# EAGLE design EventCounter_I2C (EAGLE 9.2.1)

## Sheet 1 of 2
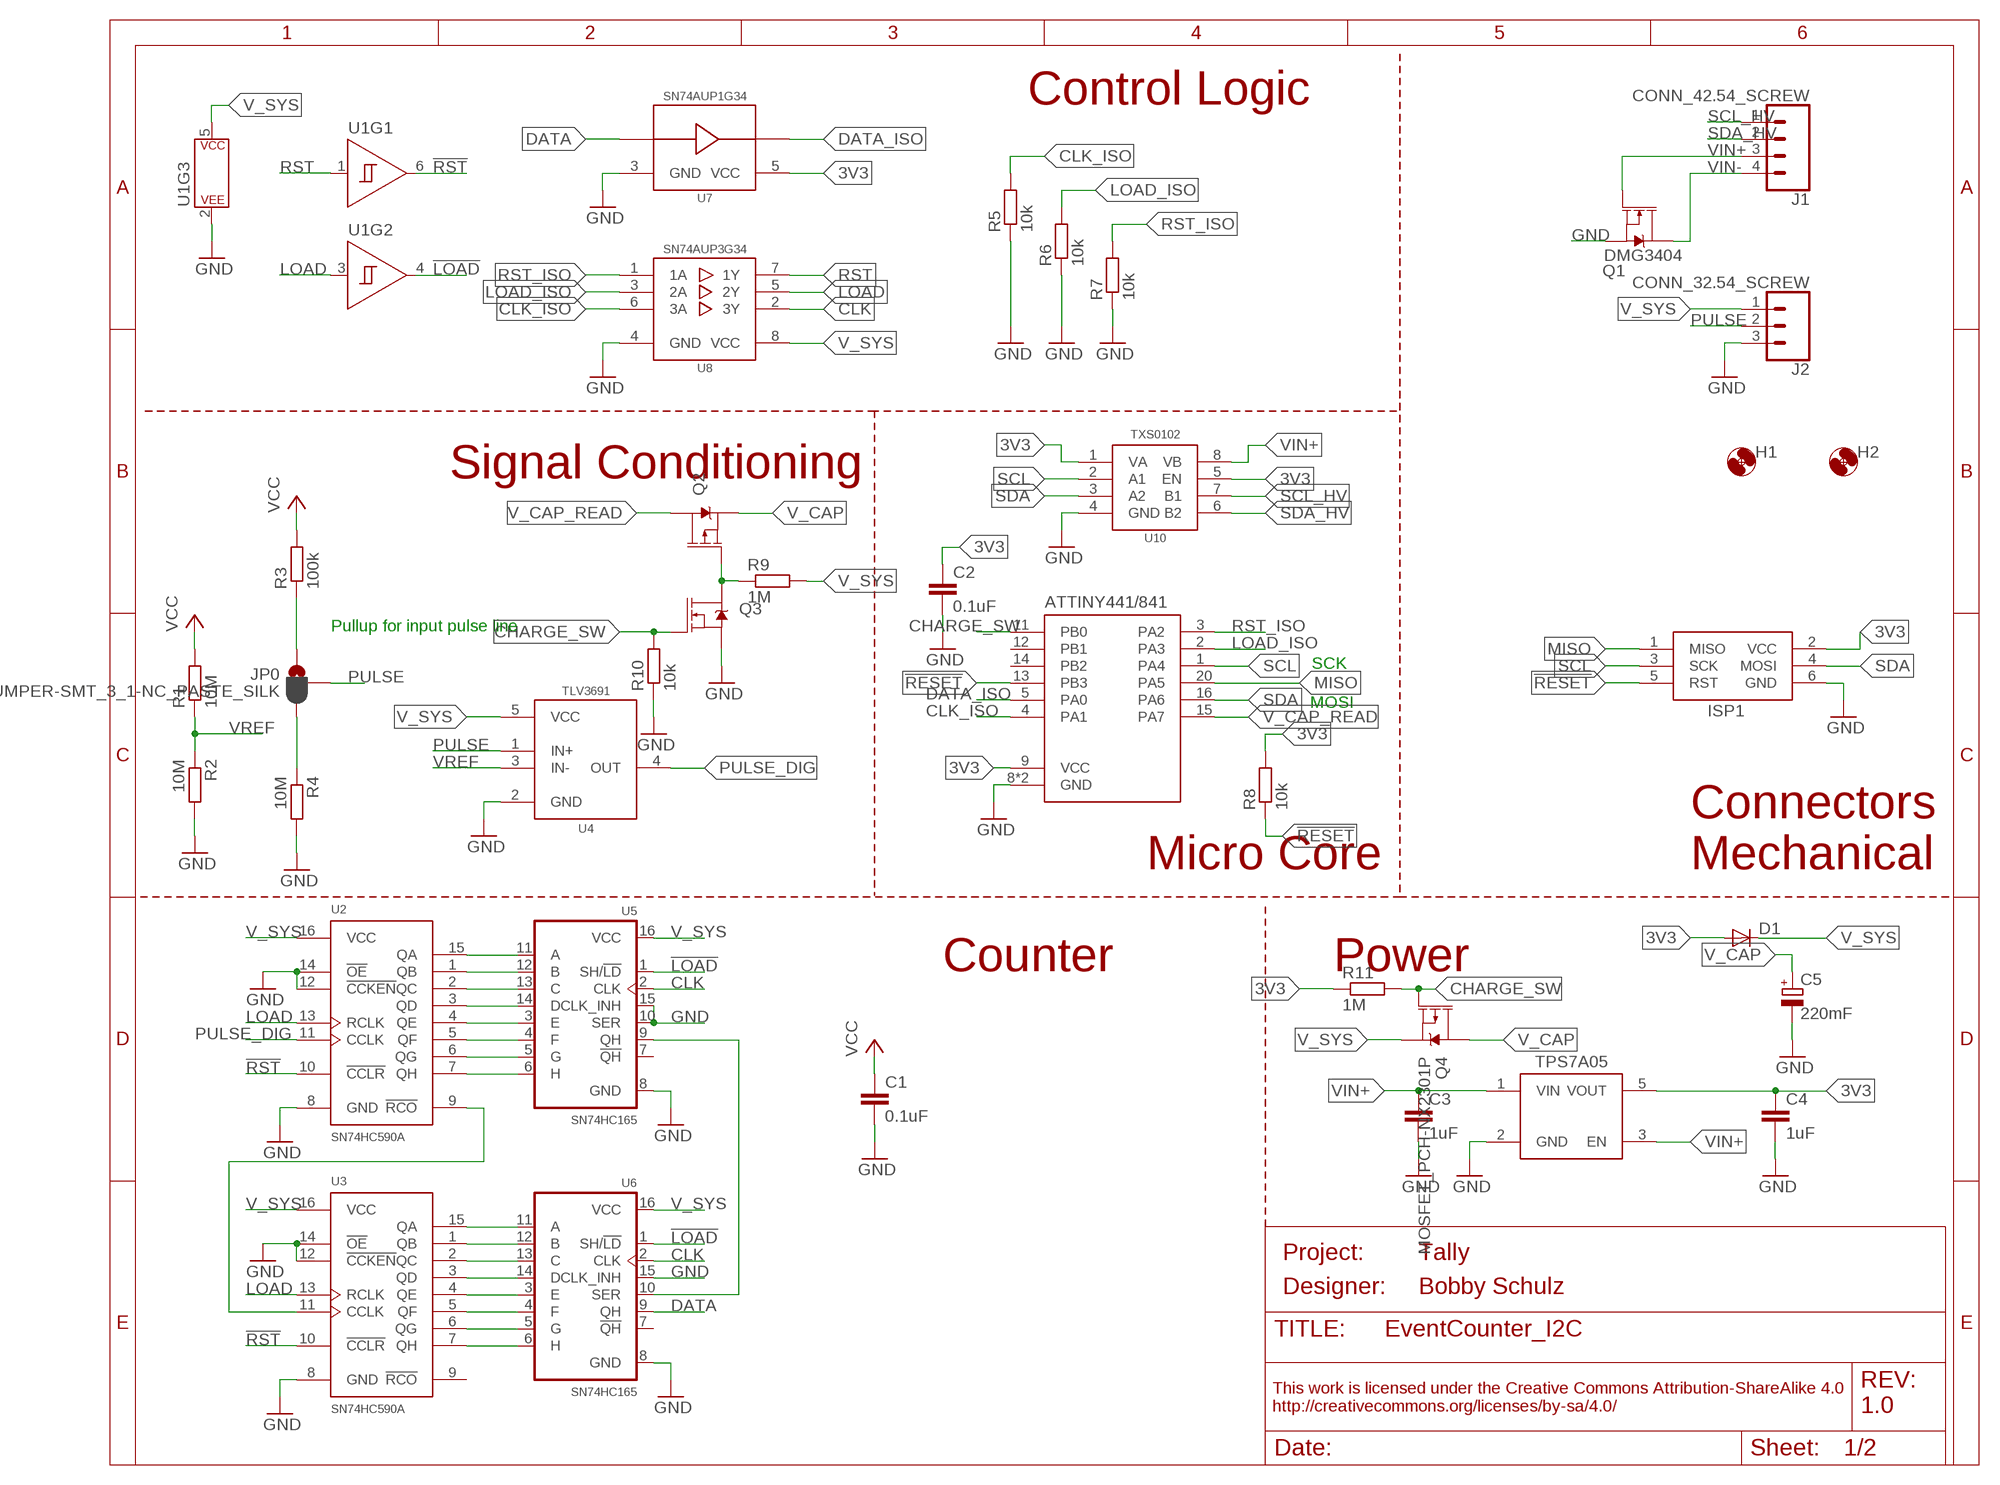
[diagram p0: schematic, sheet 1]
FRAME1 (FRAME_A_L): DESIGNER: Bobby Schulz; PROJECT: Tally; REV: 1.0

### Parts
C1  0.1uF  C-EU0.1UFC0402  [C0402]
C2  0.1uF  C-EU0.1UFC0402  [C0402]
C3  1uF  C-EU1UFC0603  [C0603]
C4  1uF  C-EU1UFC0603  [C0603]
C5  220mF  CPOL-EUHL  [HL]
D1  DIODESOD-123  [SOD-123]
H1  MOUNTING_HOLE2_NP  [2_56]
H2  MOUNTING_HOLE2_NP  [2_56]
ISP1  AVRISP1.27MM  [2X3_1.27]
J1  CONN_42.54_SCREW  [1X04_SCREW]
J2  CONN_32.54_SCREW  [1X03_SCREW]
JP0  JUMPER-SMT_3_1-NC_PASTE_SILK  [SMT-JUMPER_3_1-NC_PASTE_SILK]
Q1  DMG3404  MOSFET-NCH-DMG3404L  [SOT23-3]
Q2  MOSFET_PCH-RZM001P02  [SOT723]
Q3  MOSFET-NCH-RE1C002UN  [SC-89]
Q4  MOSFET_PCH-NX2301P  [SOT23-3]
R1  10M  R-EU_10MR0603  [R0603]
R2  10M  R-EU_10MR0603  [R0603]
R3  100k  R-EU_100KR0603  [R0603]
R4  10M  R-EU_10MR0603  [R0603]
R5  10k  R-EU_10KR0402  [R0402]
R6  10k  R-EU_10KR0402  [R0402]
R7  10k  R-EU_10KR0402  [R0402]
R8  10k  R-EU_10KR0402  [R0402]
R9  1M  R-EU_1MR0402  [R0402]
R10  10k  R-EU_10KR0402  [R0402]
R11  1M  R-EU_1MR0402  [R0402]
U1  SN74AUP2G14SC70  [DCK_R-PDSO-G6]
U2  SN74HC590AD  [SO16]
U3  SN74HC590AD  [SO16]
U4  TLV3691DCK  [DCK_R-PDSO-G5]
U5  SN74HC165PW  [TSSOP16]
U6  SN74HC165PW  [TSSOP16]
U7  SN74AUP1G34SC70  [DCK_R-PDSO-G5]
U8  SN74AUP3G34DCU  [DCU_(R-PDSO-G8)]
U9  ATTINY441/841VQFN  [VQFN-20]
U10  TXS0102DQM  [DQM_R-PX2SON-N8]
U11  TPS7A0533DBV  [SOT23-5]

### Nets
3V3: C2.1 C4.1 D1.ANODE(A) ISP1.2(VCC) R8.2 R11.1 U7.5(VCC) U9.9(VCC) U10.1(VA) U10.5(EN) U11.5(VOUT)
!LOAD: U1.4(Y) U5.1(SH/!LD) U6.1(SH/!LD)
!RESET: ISP1.5(RST) R8.1 U9.13(PB3)
!RST: U1.6(Y) U2.10(!CCLR) U3.10(!CCLR)
CHARGE_SW: Q3.1(G) Q4.1(G) R10.2 R11.2 U9.11(PB0)
CLK: U5.2(CLK) U6.2(CLK) U8.2(3Y)
CLK_ISO: R5.2 U8.6(3A) U9.4(PA1)
DATA: U6.9(QH) U7.2(A)
DATA_ISO: U7.4(Y) U9.5(PA0)
GND: C1.2 C2.2 C3.2 C4.2 C5.- ISP1.6(GND) J2.3 Q1.2(S) Q3.2(S) R2.2 R4.2 R5.1 R6.1 R7.1 R10.1 U1.2(P$V-) U2.8(GND) U2.12(!CCKEN) U2.14(!OE) U3.8(GND) U3.12(!CCKEN) U3.14(!OE) U4.2(GND) U5.8(GND) U5.10(SER) U5.15(CLK_INH) U6.8(GND) U6.15(CLK_INH) U7.3(GND) U8.4(GND) U9.8(GND) U9.EP(GND) U10.4(GND) U11.2(GND)
LOAD: U1.3(A) U2.13(RCLK) U3.13(RCLK) U8.5(2Y)
LOAD_ISO: R6.2 U8.3(2A) U9.2(PA3)
MISO: ISP1.1(MISO) U9.20(PA5)
N$1: U3.15(QA) U6.11(A)
N$2: U3.1(QB) U6.12(B)
N$3: U3.2(QC) U6.13(C)
N$4: U3.3(QD) U6.14(D)
N$5: U3.4(QE) U6.3(E)
N$6: U3.5(QF) U6.4(F)
N$7: U3.6(QG) U6.5(G)
N$8: U3.7(QH) U6.6(H)
N$9: U2.7(QH) U5.6(H)
N$10: U2.6(QG) U5.5(G)
N$11: U2.5(QF) U5.4(F)
N$12: U2.4(QE) U5.3(E)
N$13: U2.3(QD) U5.14(D)
N$14: U2.2(QC) U5.13(C)
N$15: U2.1(QB) U5.12(B)
N$16: U2.15(QA) U5.11(A)
N$17: U5.9(QH) U6.10(SER)
N$18: U2.9(!RCO) U3.11(CCLK)
N$19: JP0.3 R4.1
N$20: JP0.1 R3.1
N$21: Q2.1(G) Q3.3(D) R9.1
PULSE: J2.2 JP0.2 U4.1(IN+)
PULSE_DIG: U2.11(CCLK) U4.4(OUT)
RST: U1.1(A) U8.7(1Y)
RST_ISO: R7.2 U8.1(1A) U9.3(PA2)
SCL: ISP1.3(SCK) U9.1(PA4) U10.2(A1)
SCL_HV: J1.1 U10.7(B1)
SDA: ISP1.4(MOSI) U9.16(PA6) U10.3(A2)
SDA_HV: J1.2 U10.6(B2)
V_CAP: C5.+ Q2.2(S) Q4.3(D)
V_CAP_READ: Q2.3(D) U9.15(PA7)
V_SYS: C1.1 D1.CAT(C) J2.1 Q4.2(S) R1.2 R3.2 R9.2 U1.5(P$V+) U2.16(VCC) U3.16(VCC) U4.5(VCC) U5.16(VCC) U6.16(VCC) U8.8(VCC) ; supply symbol labelled VCC
VIN+: C3.1 J1.3 Q1.1(G) U10.8(VB) U11.1(VIN) U11.3(EN)
VIN-: J1.4 Q1.3(D)
VREF: R1.1 R2.1 U4.3(IN-)
Unconnected: U3.9(!RCO) U5.7(!QH) U6.7(!QH) U9.12(PB1) U9.14(PB2)

### Notes on the sheet
- Control Logic
- Signal Conditioning
- Pullup for input pulse line
- SCK
- MOSI
- Micro Core
- Connectors
  Mechanical
- Counter | Power

## Sheet 2 of 2

## Library data of the parts
C1 C2 = bschulz_passives:C-EU: CAPACITOR, European symbol; DIGIKEY: 490-4759-1-ND; MF: Murata; MPN: GCM155R71C104KA55D
C3 C4 = bschulz_passives:C-EU: CAPACITOR, European symbol; DIGIKEY: 490-10479-1-ND; MF: Murata; MPN: GRM188R61C105KA12D
C5 = bschulz_passives:CPOL-EU: POLARIZED CAPACITOR, European symbol; DIGIKEY: 604-1020-1-ND; MF: Elna; MPN: DSK-3R3H224U-HL
D1 = bschulz:DIODE: Genaric Diode; DIGIKEY: BAT43W-FDICT-ND; MF: Diodes Incorporated; MPN: BAT43W-7-F
H1 H2 = bschulz:MOUNTING_HOLE: Genaric Mechanical Mounting Hole Hole diameter based on max body diameter + 15% Keepout ring is for diameter of socket cap screw (minimum required clearance) TPlace ring is for diameter of pan head screw (recomended clearance) Specifications: Socket Cap <http://fastener-express.com/fastener-technical/SocketscapSS-Alloy.pdf> Button Head Socket Cap <http://fastener-express.com/fastener-technical/Button-Socket-alloy.pdf> Pan Head <http://fastener-express.com/fastener-technical/pan-machine-Screws.pdf>
ISP1 = bschulz:AVRISP: AVR ISP HEADER Standard 6 pin header for AVR programming
J1 = bschulz:CONN_4: Genaric 4 terminal header Digikey 2.54_SCREW <https://www.digikey.com/product-detail/en/on-shore-technology-inc/OSTVN04A150/ED10563-ND/1588864>; DIGIKEY: ED10563-ND; MF: On Shore; MPN: OSTVN04A150
J2 = bschulz:CONN_3: Genaric 3 terminal header Digikey 2.54_SCREW <https://www.digikey.com/product-detail/en/on-shore-technology-inc/OSTVN03A150/ED10562-ND/1588863> 3.5_SCREW <https://www.digikey.com/product-detail/en/on-shore-technology-inc/OSTTE030161/ED2636-ND/614585>; DIGIKEY: ED10562-ND; MF: On Shore; MPN: OSTVN03A150
JP0 = SparkFun-Jumpers:JUMPER-SMT_3_1-NC_PASTE: Normally closed solder jumper (1 of 2 connections) This jumper has an aperture in the stencil to allow solder paste to bridge one of the two connections. One connection is normally closed (NC), while the other is normally open (NO). Wick off the solder to open the connection. Reapply solder to reclose the connection. Apply solder to the other side instead to change the current path.
Q1 = bschulz:MOSFET-NCH: N-channel MOSFETs Voltage controlled devices that allow control of high current outputs. SparkFun Products: SparkFun OpenScale <https://www.sparkfun.com/products/13261> SparkFun Digital Sandbox <https://www.sparkfun.com/products/12651> SparkFun Monster Moto Shield <https://www.sparkfun.com/products/10182> SparkFun MOSFET Power Controller <https://www.sparkfun.com/products/11214>; DIGIKEY: DMG3404L-7DICT-ND; MF: Diodes Incorporated; MPN: DMG3404L-7
Q2 = bschulz:MOSFET_PCH: P-channel MOSFETs Voltage controlled devices that allow control of high current outputs. SparkFun Products: SparkFun ESP32 Thing <https://www.sparkfun.com/products/13907> SparkFun ESP8266 Thing <https://www.sparkfun.com/products/13231>; DIGIKEY: RZM001P02T2LCT-ND; MF: Rohm; MPN: RZM001P02T2L
Q3 = bschulz:MOSFET-NCH: N-channel MOSFETs Voltage controlled devices that allow control of high current outputs. SparkFun Products: SparkFun OpenScale <https://www.sparkfun.com/products/13261> SparkFun Digital Sandbox <https://www.sparkfun.com/products/12651> SparkFun Monster Moto Shield <https://www.sparkfun.com/products/10182> SparkFun MOSFET Power Controller <https://www.sparkfun.com/products/11214>; DIGIKEY: RE1C002UNTCLCT-ND; MF: Rohm; MPN: RE1C002UNTCL
Q4 = bschulz:MOSFET_PCH: P-channel MOSFETs Voltage controlled devices that allow control of high current outputs. SparkFun Products: SparkFun ESP32 Thing <https://www.sparkfun.com/products/13907> SparkFun ESP8266 Thing <https://www.sparkfun.com/products/13231>; DIGIKEY: 1727-1148-1-ND; MF: Nexperia; MPN: NX2301P,215
R1 R2 R4 = bschulz_passives:R-EU_: RESISTOR, European symbol Digikey Parts: Yageo, 0402 <https://www.digikey.com/products/en/resistors/chip-resistor-surface-mount/52?k=&pkeyword=&sf=0&FV=ffec1104%2Cfffc000d%2C1c0002%2C440067%2C1f140000%2Cffe00034%2C400004&quantity=&ColumnSort=0&page=1&stock=1&pageSize=25> Yageo, 0603 <https://www.digikey.com/products/en/resistors/chip-resistor-surface-mount/52?k=&pkeyword=&s=4356&s=47360&sf=0&FV=fffc000d%2C1c0002%2C142c040c%2C1f140000%2Cffe00034&quantity=10&ColumnSort=1000011&page=1&stock=1&pageSize=25> Panasonic, 0603 <https://www.digikey.com/products/en/resistors/chip-resistor-surface-mount/52?k=&pkeyword=&pv252=68&sf=0&FV=ffec373d%2C1c0002%2C142c040c%2C1f140000%2Cffe00034%2C80002%2Cc0001&quantity=&ColumnSort=0&page=1&stock=1&pageSize=25> Panasonic, precision, 0603 <https://www.digikey.com/products/en/resistors/chip-resistor-surface-mount/52?FV=ffec4907%2Cfffc000a%2Cc0172%2C142c040c%2C1f140000%2Cffe00034%2C1c0002&quantity=100&ColumnSort=2085&page=1&stock=1&pageSize=25> Panasonic, 0805 <https://www.digikey.com/products/en/resistors/chip-resistor-surface-mount/52?k=&pkeyword=&pv3=1&sf=0&FV=ffec373d%2C1c0002%2C1f140000%2Cffe00034%2C142c040d&quantity=&ColumnSort=0&page=1&stock=1&pageSize=25> Rohm, current sense <https://www.digikey.com/products/en/resistors/chip-resistor-surface-mount/52?k=&pkeyword=&pv3=1&sf=0&FV=ffecb688%2C1f140000%2Cffe00034%2C1c0002&quantity=&ColumnSort=0&page=1&stock=1&pageSize=25> Vishay, pulse proof automotive <https://www.digikey.com/products/en/resistors/chip-resistor-surface-mount/52?k=&pkeyword=&pv7=2&sf=0&FV=ffec5d6b%2Cffe00034%2C1f140000&quantity=&ColumnSort=0&page=1&stock=1&pageSize=25>; DIGIKEY: RMCF0603FT10M0CT-ND; MF: Stackpole; MPN: RMCF0603FT10M0; VALUE_PART: 10M
R3 = bschulz_passives:R-EU_: RESISTOR, European symbol Digikey Parts: Yageo, 0402 <https://www.digikey.com/products/en/resistors/chip-resistor-surface-mount/52?k=&pkeyword=&sf=0&FV=ffec1104%2Cfffc000d%2C1c0002%2C440067%2C1f140000%2Cffe00034%2C400004&quantity=&ColumnSort=0&page=1&stock=1&pageSize=25> Yageo, 0603 <https://www.digikey.com/products/en/resistors/chip-resistor-surface-mount/52?k=&pkeyword=&s=4356&s=47360&sf=0&FV=fffc000d%2C1c0002%2C142c040c%2C1f140000%2Cffe00034&quantity=10&ColumnSort=1000011&page=1&stock=1&pageSize=25> Panasonic, 0603 <https://www.digikey.com/products/en/resistors/chip-resistor-surface-mount/52?k=&pkeyword=&pv252=68&sf=0&FV=ffec373d%2C1c0002%2C142c040c%2C1f140000%2Cffe00034%2C80002%2Cc0001&quantity=&ColumnSort=0&page=1&stock=1&pageSize=25> Panasonic, precision, 0603 <https://www.digikey.com/products/en/resistors/chip-resistor-surface-mount/52?FV=ffec4907%2Cfffc000a%2Cc0172%2C142c040c%2C1f140000%2Cffe00034%2C1c0002&quantity=100&ColumnSort=2085&page=1&stock=1&pageSize=25> Panasonic, 0805 <https://www.digikey.com/products/en/resistors/chip-resistor-surface-mount/52?k=&pkeyword=&pv3=1&sf=0&FV=ffec373d%2C1c0002%2C1f140000%2Cffe00034%2C142c040d&quantity=&ColumnSort=0&page=1&stock=1&pageSize=25> Rohm, current sense <https://www.digikey.com/products/en/resistors/chip-resistor-surface-mount/52?k=&pkeyword=&pv3=1&sf=0&FV=ffecb688%2C1f140000%2Cffe00034%2C1c0002&quantity=&ColumnSort=0&page=1&stock=1&pageSize=25> Vishay, pulse proof automotive <https://www.digikey.com/products/en/resistors/chip-resistor-surface-mount/52?k=&pkeyword=&pv7=2&sf=0&FV=ffec5d6b%2Cffe00034%2C1f140000&quantity=&ColumnSort=0&page=1&stock=1&pageSize=25>; DIGIKEY: RC0402FR-071ML; MF: Yageo; MPN: RC0603FR-07100KL; VALUE_PART: 100k
R5-R8 R10 = bschulz_passives:R-EU_: RESISTOR, European symbol Digikey Parts: Yageo, 0402 <https://www.digikey.com/products/en/resistors/chip-resistor-surface-mount/52?k=&pkeyword=&sf=0&FV=ffec1104%2Cfffc000d%2C1c0002%2C440067%2C1f140000%2Cffe00034%2C400004&quantity=&ColumnSort=0&page=1&stock=1&pageSize=25> Yageo, 0603 <https://www.digikey.com/products/en/resistors/chip-resistor-surface-mount/52?k=&pkeyword=&s=4356&s=47360&sf=0&FV=fffc000d%2C1c0002%2C142c040c%2C1f140000%2Cffe00034&quantity=10&ColumnSort=1000011&page=1&stock=1&pageSize=25> Panasonic, 0603 <https://www.digikey.com/products/en/resistors/chip-resistor-surface-mount/52?k=&pkeyword=&pv252=68&sf=0&FV=ffec373d%2C1c0002%2C142c040c%2C1f140000%2Cffe00034%2C80002%2Cc0001&quantity=&ColumnSort=0&page=1&stock=1&pageSize=25> Panasonic, precision, 0603 <https://www.digikey.com/products/en/resistors/chip-resistor-surface-mount/52?FV=ffec4907%2Cfffc000a%2Cc0172%2C142c040c%2C1f140000%2Cffe00034%2C1c0002&quantity=100&ColumnSort=2085&page=1&stock=1&pageSize=25> Panasonic, 0805 <https://www.digikey.com/products/en/resistors/chip-resistor-surface-mount/52?k=&pkeyword=&pv3=1&sf=0&FV=ffec373d%2C1c0002%2C1f140000%2Cffe00034%2C142c040d&quantity=&ColumnSort=0&page=1&stock=1&pageSize=25> Rohm, current sense <https://www.digikey.com/products/en/resistors/chip-resistor-surface-mount/52?k=&pkeyword=&pv3=1&sf=0&FV=ffecb688%2C1f140000%2Cffe00034%2C1c0002&quantity=&ColumnSort=0&page=1&stock=1&pageSize=25> Vishay, pulse proof automotive <https://www.digikey.com/products/en/resistors/chip-resistor-surface-mount/52?k=&pkeyword=&pv7=2&sf=0&FV=ffec5d6b%2Cffe00034%2C1f140000&quantity=&ColumnSort=0&page=1&stock=1&pageSize=25>; DIGIKEY: 311-10KJRCT-ND; MF: Yageo; MPN: RC0402JR-0710KL; VALUE_PART: 10k
R9 R11 = bschulz_passives:R-EU_: RESISTOR, European symbol Digikey Parts: Yageo, 0402 <https://www.digikey.com/products/en/resistors/chip-resistor-surface-mount/52?k=&pkeyword=&sf=0&FV=ffec1104%2Cfffc000d%2C1c0002%2C440067%2C1f140000%2Cffe00034%2C400004&quantity=&ColumnSort=0&page=1&stock=1&pageSize=25> Yageo, 0603 <https://www.digikey.com/products/en/resistors/chip-resistor-surface-mount/52?k=&pkeyword=&s=4356&s=47360&sf=0&FV=fffc000d%2C1c0002%2C142c040c%2C1f140000%2Cffe00034&quantity=10&ColumnSort=1000011&page=1&stock=1&pageSize=25> Panasonic, 0603 <https://www.digikey.com/products/en/resistors/chip-resistor-surface-mount/52?k=&pkeyword=&pv252=68&sf=0&FV=ffec373d%2C1c0002%2C142c040c%2C1f140000%2Cffe00034%2C80002%2Cc0001&quantity=&ColumnSort=0&page=1&stock=1&pageSize=25> Panasonic, precision, 0603 <https://www.digikey.com/products/en/resistors/chip-resistor-surface-mount/52?FV=ffec4907%2Cfffc000a%2Cc0172%2C142c040c%2C1f140000%2Cffe00034%2C1c0002&quantity=100&ColumnSort=2085&page=1&stock=1&pageSize=25> Panasonic, 0805 <https://www.digikey.com/products/en/resistors/chip-resistor-surface-mount/52?k=&pkeyword=&pv3=1&sf=0&FV=ffec373d%2C1c0002%2C1f140000%2Cffe00034%2C142c040d&quantity=&ColumnSort=0&page=1&stock=1&pageSize=25> Rohm, current sense <https://www.digikey.com/products/en/resistors/chip-resistor-surface-mount/52?k=&pkeyword=&pv3=1&sf=0&FV=ffecb688%2C1f140000%2Cffe00034%2C1c0002&quantity=&ColumnSort=0&page=1&stock=1&pageSize=25> Vishay, pulse proof automotive <https://www.digikey.com/products/en/resistors/chip-resistor-surface-mount/52?k=&pkeyword=&pv7=2&sf=0&FV=ffec5d6b%2Cffe00034%2C1f140000&quantity=&ColumnSort=0&page=1&stock=1&pageSize=25>; DIGIKEY: 311-1.00MLRCT-ND; MF: Yageo; MPN: RC0402FR-071ML; VALUE_PART: 1M
U1 = bschulz:SN74*2G14: SN74x2G14 - Dual Schmitt Triger Inverter Characteristics: VCC: 0.8 ~ 3.6V (1.65 ~ 5.5V for LVC Version) Operating Temperature: -40°C to 85°C (-40°C to 125°C for LVC Version) fmax = 2.5 MHz (for Vcc =1.65v, high for higher Vcc) Output Current = ± 4 mA (± 32 mA for LVC Version) Digikey: 296-27361-1-ND (SC70, AUP Low Voltage) <https://www.digikey.com/product-detail/en/texas-instruments/SN74AUP2G14DCKR/296-27361-1-ND/2279322> 296-13011-1-ND (SC70, LVC High Voltage) <https://www.digikey.com/product-detail/en/texas-instruments/SN74LVC2G14DCKR/296-13011-1-ND/479732>; DIGIKEY: 296-27361-1-ND; MF: TI; MPN: SN74AUP2G14DCKR
U2 U3 = bschulz:SN74HC590A: SN74HC590A - 8 bit binary counter with direct clear Characteristics: VCC: 2~6V Operating Temperature: -40°C to 85°C fmax = 2.5 MHz (for Vcc = 2v, high for higher Vcc) Digikey: 296-8340-5-ND (SOIC) <https://www.digikey.com/product-detail/en/texas-instruments/SN74HC590AD/296-8340-5-ND/376756> 296-1599-5-ND (DIP) <https://www.digikey.com/product-detail/en/texas-instruments/SN74HC590AN/296-1599-5-ND/277245>; DIGIKEY: 296-8340-5-ND; MF: TI; MPN: SN74HC590AD
U4 = bschulz:TLV3691: TLV3691 - Nanopower Analog Comparator Characteristics: Vin: 0.9V ~ 6.5V (± 0.45V ~ ± 3.25V) Response Time: 24us Push-Pull Output IQ: 75nA Operating Temperature: -40°C to 125°C Digikey: 296-37910-1-ND (DCK) <https://www.digikey.com/products/en/integrated-circuits-ics/linear-comparators/692?k=TLV3691&k=&pkeyword=TLV3691&sv=0&pv7=2&sf=0&FV=142c0371%2Cffe002b4&quantity=&ColumnSort=1000011&page=1&stock=1&pageSize=25> 296-37242-6-ND (DPF) <https://www.digikey.com/product-detail/en/texas-instruments/TLV3691IDPFR/296-37242-6-ND/4695352>; DIGIKEY: 296-37910-1-ND; MF: TI; MPN: TLV3691IDCKR
U5 U6 = bschulz:SN74HC165: SN74HC165 - 8 bit PISO shift register Characteristics: VCC: 2~6V Operating Temperature: -40°C to 85°C fmax = 2.5 MHz (for Vcc = 2v, high for higher Vcc) Digikey: 296-8253-1-ND (TSSOP) <https://www.digikey.com/product-detail/en/texas-instruments/SN74HC165PWR/296-8253-1-ND/376670> 296-8250-1-ND (SOIC) <https://www.digikey.com/product-detail/en/texas-instruments/SN74HC165DR/296-8250-1-ND/405259> 296-8251-5-ND (DIP) <https://www.digikey.com/product-detail/en/texas-instruments/SN74HC165N/296-8251-5-ND/376966>; DIGIKEY: 296-8253-1-ND; MF: TI; MPN: SN74HC165PWR
U7 = bschulz:SN74AUP1G34: SN74AUP1G34 - Logic Buffer Characteristics: VCC: 0.8~3.6V Operating Temperature: -40°C to 85°C Number of Gates: 1 /li> Inverting: No Digikey: 296-17230-1-ND (SC70, DCK) <https://www.digikey.com/product-detail/en/texas-instruments/SN74LVC1G34DCKR/296-17230-1-ND/669841>; DIGIKEY: 296-17230-1-ND; MF: TI; MPN: SN74LVC1G34DCKR
U8 = bschulz:SN74AUP3G34: SN74AUP3G34 - Logic Buffer Characteristics: VCC: 0.8~3.6V Operating Temperature: -40°C to 85°C Number of Gates: 3 /li> Inverting: No Digikey: 296-27503-1-ND (UQFN, RSE) <https://www.digikey.com/scripts/DkSearch/dksus.dll?Detail&itemSeq=257211059&uq=636588853324239862> 296-36973-1-ND (XFDFN, DQE) <https://www.digikey.com/product-detail/en/texas-instruments/SN74AUP3G34DQER/296-36973-1-ND/4428921> 296-25595-1-ND (VFSOP, DCU) <https://www.digikey.com/product-detail/en/texas-instruments/SN74AUP3G34DCUR/296-25595-1-ND/2202056>; DIGIKEY: 296-25595-1-ND; MF: TI; MPN: SN74AUP3G34DCUR
U9 = bschulz:ATTINY441/841: ATtiny841/441 8 bit AVR Microcontroller Features: (441/841) Vcc: 1.8 ~ 5.5V Clock: Up to 16MHz, Internal 8MHz FRC, 32kHz RC Flash Memory: 4/8K SRAM: 256/512B EEPROM: 256/512B ADC: 10b, 12 port USART: Yes, x2 SPI: Yes I2C: Yes, slave only Notes: 2 analog comp. Digikey: ATTINY841-MMHRCT-ND (VQFN) <https://www.digikey.com/product-detail/en/microchip-technology/ATTINY841-MMHR/ATTINY841-MMHRCT-ND/4437440> ATTINY841-SSU-ND (SOIC) <https://www.digikey.com/product-detail/en/microchip-technology/ATTINY841-SSU/ATTINY841-SSU-ND/4437435>; DIGIKEY: ATTINY841-MMHRCT-ND; MF: Atmel; MPN: ATTINY841-MMHR
U10 = bschulz:TXS0102: TXS0102 - 2 Channel Bidirectional Voltage Level Translator Characteristics: Vcc: 1.65 ~ 3.6V (Port A), 2.3 ~ 5.5V (Port B) IQ: 14.4μA Output Current: 50mA Output Type: Open Drain/Push-Pull Operating Temperature: -40°C to 85°C Digikey: 296-28368-1-ND (DQE) <https://www.digikey.com/product-detail/en/texas-instruments/TXS0102DQER/296-28368-1-ND/2625893> 296-28435-1-ND (DQM) <https://www.digikey.com/product-detail/en/texas-instruments/TXS0102DQMR/296-28435-1-ND/2638910> 296-21931-1-ND (DCU) <https://www.digikey.com/product-detail/en/texas-instruments/TXS0102DCUR/296-21931-1-ND/1629284>; DIGIKEY: 296-28435-1-ND; MF: TI; MPN: TXS0102DQMR
U11 = bschulz:TPS7A05*: TPS7A05* - Ultra Low Power Low Dropout Linear Regulator Characteristics: Vin: 1.4V ~ 5.5V Vout: 0.8, 1.0, 1.2, 1.5, 1.8, 2.5, 2.85, 3.3V fixed IQ: 1μA typ, 3μA max Voltage Accuracy: 1% typ, 3% max Output Current: 200 mA Operating Temperature: -40°C to 125°C Mouser: TPS7A0533 (3.3V Fixed) <https://www.mouser.com/ProductDetail/Texas-Instruments/TPS7A0533PDBVR?qs=sGAEpiMZZMsGz1a6aV8DcD1rpA6FsR3J1Mp5DdTpiXw%3d> TPS7A0518 (1.8V Fixed) <https://www.mouser.com/ProductDetail/Texas-Instruments/TPS7A0518PDBVR?qs=sGAEpiMZZMsGz1a6aV8DcD1rpA6FsR3J1f7DNYacdSI%3d>; DIGIKEY: 296-50256-1-ND; MF: TI; MOUSER: 595-TPS7A0533PDBVR; MPN: TPS7A0533PDBVR

## Board
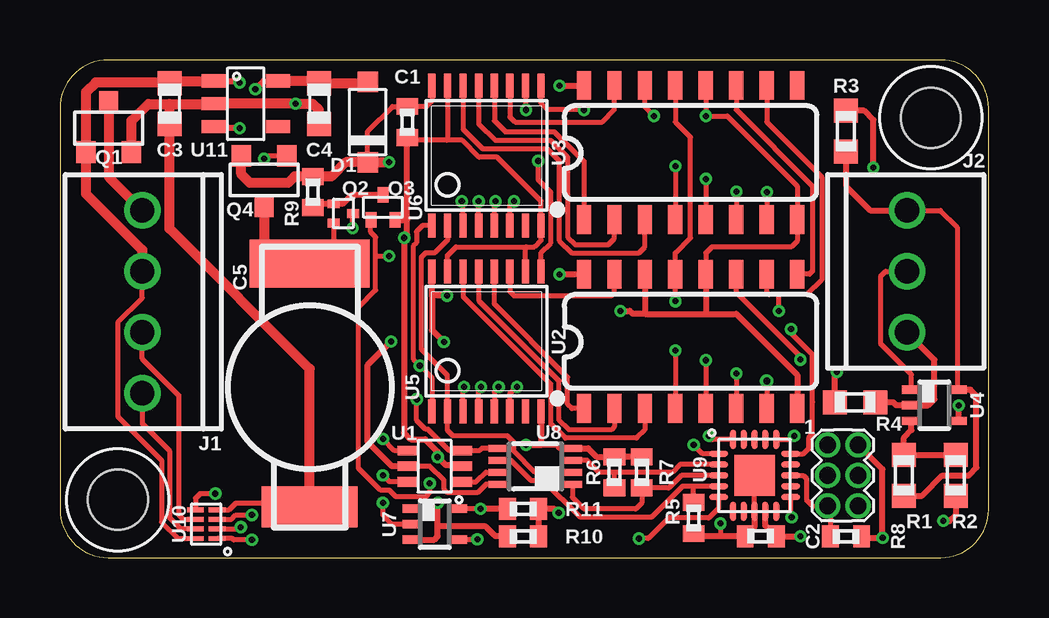
[diagram p1: board, top side]
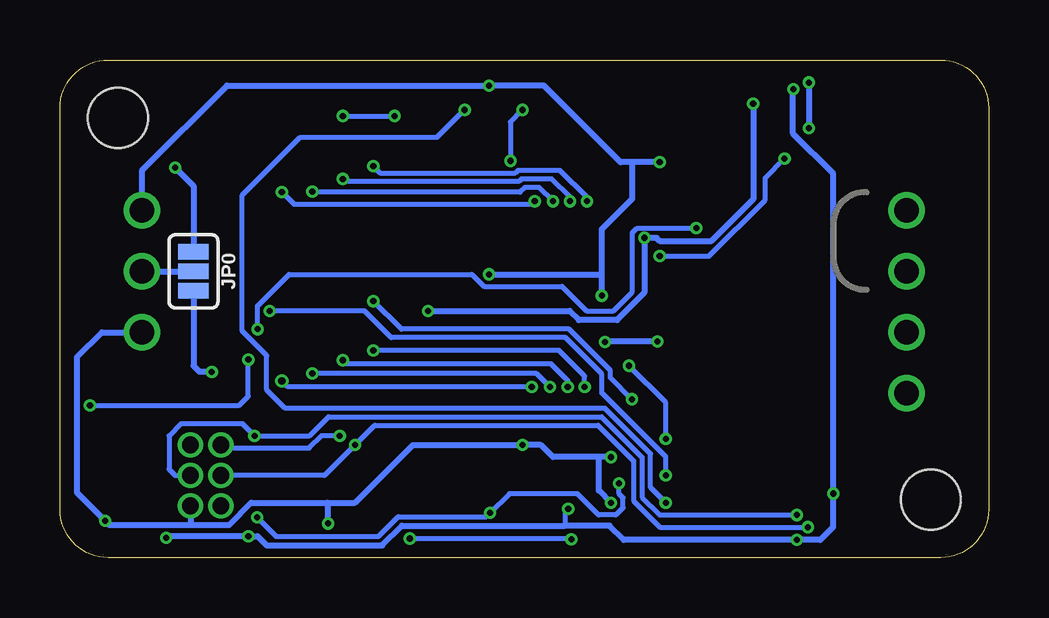
[diagram p2: board, bottom side, seen from below]

Size 38.72 x 20.75 mm. Coordinates in mm from the lower left corner, seen from the top.
Outline: 0,18.75 0,2 arc90 2,0 36.72,0 arc90 38.72,2 38.72,18.75 arc90 36.72,20.75 2,20.75 arc90 0,18.75
Copper layers (1*16): Top 0.035559375mm / dielectric 1.6mm / Bottom 0.035559375mm
Design rules "oshpark-2layer": minimum track width 6mil, minimum drill 10mil, track to track 6mil, track to pad 6mil, pad to pad 6mil, via to via 6mil, smd to smd 6mil, copper to edge 15mil, drill to drill 6mil, minimum pad ring 5mil, minimum via ring 5mil, stop-mask expansion 2.5mil, vias tented up to drill 0mil, thermal gap 10mil

### Footprints (pad centres in the part's own frame; a part is rotated, then mirrored left to right if it is on the bottom)
C0402 = smd 0.7 x 0.9: 1 -0.65,0; 2 0.65,0
C0603 = smd 1 x 1: 1 -0.85,0; 2 0.85,0
HL = smd 5 x 2: + 0,5.15 | smd 4 x 1.7: - 0,-5
SOD-123 = smd 0.85 x 0.85: ANODE 1.675,0; CAT -1.675,0
2_56 = hole 2.5: 0,0
2X3_1.27 = drill 0.7 pad 1.05: 1 -1.27,-0.635; 2 -1.27,0.635; 3 0,-0.635; 4 0,0.635; 5 1.27,-0.635; 6 1.27,0.635
1X04_SCREW = drill 1.016: 1 -3.81,0; 2 -1.27,0; 3 1.27,0; 4 3.81,0
1X03_SCREW = drill 1.016: 1 -2.54,0; 2 0,0; 3 2.54,0
SMT-JUMPER_3_1-NC_PASTE_SILK = smd 0.635 x 1.27: 1 -0.813,0; 2 0,0; 3 0.813,0
SOT23-3 = smd 0.8 x 0.9: 1 -0.95,-1; 2 0.95,-1; 3 0,1.1
SOT723 = smd 0.37 x 0.5: 1 -0.4,-0.4; 2 0.4,-0.4; 3 0,0.4
SC-89 = smd 0.46 x 0.65: 1 -0.5,-0.525; 2 0.5,-0.525; 3 0,0.525
R0603 = smd 1 x 1: 1 -0.85,0; 2 0.85,0
R0402 = smd 0.7 x 0.9: 1 -0.65,0; 2 0.65,0
DCK_R-PDSO-G6 = smd 0.4 x 0.9: 1 -0.65,-1.1; 2 0,-1.1; 3 0.65,-1.1; 4 0.65,1.1; 5 0,1.1; 6 -0.65,1.1
SO16 = smd 0.6 x 1.2: 1 -4.445,-2.8; 2 -3.175,-2.8; 3 -1.905,-2.8; 4 -0.635,-2.8; 5 0.635,-2.8; 6 1.905,-2.8; 7 3.175,-2.8; 8 4.445,-2.8; 9 4.445,2.8; 10 3.175,2.8; 11 1.905,2.8; 12 0.635,2.8; 13 -0.635,2.8; 14 -1.905,2.8; 15 -3.175,2.8; 16 -4.445,2.8
DCK_R-PDSO-G5 = smd 0.35 x 0.8: 1 -0.65,-0.95; 2 0,-0.95; 3 0.65,-0.95; 4 0.65,0.95; 5 -0.65,0.95
TSSOP16 = smd 0.305 x 0.991: 1 -2.275,-2.918; 2 -1.625,-2.918; 3 -0.975,-2.918; 4 -0.325,-2.918; 5 0.325,-2.918; 6 0.975,-2.918; 7 1.625,-2.918; 8 2.275,-2.918; 9 2.275,2.918; 10 1.625,2.918; 11 0.975,2.918; 12 0.325,2.918; 13 -0.325,2.918; 14 -0.975,2.918; 15 -1.625,2.918; 16 -2.275,2.918
DCU_(R-PDSO-G8) = smd 0.3 x 0.8: 1 -0.75,-1.55; 2 -0.25,-1.55; 3 0.25,-1.55; 4 0.75,-1.55; 5 0.75,1.55; 6 0.25,1.55; 7 -0.25,1.55; 8 -0.75,1.55
VQFN-20 = smd 0.8 x 0.25: 1 -1.5,0.9; 2 -1.5,0.45; 3 -1.5,0; 4 -1.5,-0.45; 5 -1.5,-0.9; 11 1.5,-0.9; 12 1.5,-0.45; 13 1.5,0; 14 1.5,0.45; 15 1.5,0.9 | smd 0.25 x 0.8: 6 -0.9,-1.5; 7 -0.45,-1.5; 8 0,-1.5; 9 0.45,-1.5; 10 0.9,-1.5; 16 0.9,1.5; 17 0.45,1.5; 18 0,1.5; 19 -0.45,1.5; 20 -0.9,1.5 | smd 1.7 x 1.7: EP 0,0
DQM_R-PX2SON-N8 = smd 0.2 x 0.7: 1 -0.6,-0.45; 2 -0.2,-0.45; 3 0.2,-0.45; 4 0.6,-0.45; 5 0.6,0.45; 6 0.2,0.45; 7 -0.2,0.45; 8 -0.6,0.45
SOT23-5 = smd 0.55 x 1: 1 -0.95,-1.35; 2 0,-1.35; 3 0.95,-1.35; 4 0.95,1.35; 5 -0.95,1.35

### Placement (x,y rotation side)
C1  14.48,18.16 270 top
C2  29.21,0.89 180 top
C3  4.57,18.92 270 top
C4  10.79,18.92 270 top
C5  10.41,7.11 0 top
D1  12.83,18.16 90 top
H1  2.41,2.41 0 top
H2  36.3,18.34 0 top
ISP1  32.64,3.43 270 top
J1  3.43,10.67 90 top
J2  35.31,11.93 270 top
JP0  33.15,11.94 270 bottom
Q1  2.03,17.91 0 top
Q2  11.81,14.35 270 top
Q3  13.46,14.61 0 top
Q4  8.51,15.75 180 top
R1  35.18,3.43 270 top
R2  37.34,3.43 270 top
R3  32.77,17.78 270 top
R4  33.15,6.48 0 top
R5  26.42,1.65 90 top
R6  23.11,3.56 270 top
R7  24.26,3.56 270 top
R8  32.77,0.89 0 top
R9  10.54,15.24 90 top
R10  1M  [R0402]  19.3,0.89 0 top
R11  10k  [R0402]  19.3,2.03 0 top
U1  15.62,3.81 90 top
U2  26.29,9.02 0 top
U3  26.29,16.89 0 top
U4  36.45,6.35 270 top
U5  17.78,9.02 0 top
U6  17.78,16.76 0 top
U7  15.62,1.4 270 top
U8  19.81,3.81 90 top
U9  28.96,3.43 0 top
U10  6.1,1.4 90 top
U11  7.75,18.92 270 top

### Tracks (layer width: path | path; a pad name or v marks a point on that pad's centre or on a via)
3V3  (via drill 0.25)
  Top 0.2: v8,0.74 7.24,0.74 7.18,0.8 U10.1 | U7.5 17.51,2.05 v17.53,2.03 | v6.48,2.67 5.84,2.67 5.65,2.47 U10.5
  Top 0.254: U9.9 29.41,1.34 C2.1 v30.86,0.89 | ISP1.2 34.29,3.68 v34.29,0.82 33.48,0.82 R8.2 | 9.08,19.87 U11.5 8.49,19.87 v8.15,19.53 | R11.1 v17.53,2.03
  Top 0.406: U11.5 10.7,19.87 C4.1 12.76,19.77 D1.ANODE
  Bottom 0.2: v17.53,2.03 17.65,1.91 17.65,1.33
  Bottom 0.254: v34.29,0.82 34.22,0.89 v30.86,0.89 30.48,0.89 30.1,0.51 25.28,0.51 24.46,1.33 17.65,1.33 15.8,1.33 15.21,0.74 v8,0.74 7.02,0.74 6.48,1.28 v6.48,2.67 6.48,16.01 8.15,17.69 v8.15,19.53
!LOAD  (via drill 0.25)
  Top 0.2: U1.4 13.96,4.46 v13.46,4.95 | v15,8.01 14.72,8.29 14.72,12.99 14.86,13.12 14.86,13.59 15.12,13.85 U6.1 | v15,8.01 15.51,7.5 U5.1 | v15,8 v15,8.01
  Bottom 0.2: v13.46,4.95 13.46,6.46 v15,8
!RESET
  Top 0.2: R8.1 32.12,2.05 ISP1.5 31.37,2.16 31.11,2.41 31.11,3.3 30.99,3.43 U9.13
!RST  (via drill 0.25)
  Top 0.2: U3.10 29.46,18.16 31.75,15.88 31.75,11.58 31.14,10.96 29.97,10.96 | U2.10 29.46,11.05 29.55,10.96 29.97,10.96 | U1.6 13.73,3.16 v13.46,3.43 | v29.97,10.29 29.97,10.96
  Bottom 0.2: v13.46,3.43 13.46,4.19 16.13,6.86 16.13,7.66 17.64,9.17 24.91,9.17 26.03,10.29 v29.97,10.29
CHARGE_SW  (via drill 0.25)
  Top 0.2: U9.11 30.46,1.72 v30.5,1.68 | v15.41,3.09 15.41,2.71 15.24,2.54 14.01,2.54 13.74,2.81 13.37,2.81 12.45,3.73 12.45,10.44 13.17,11.16 13.17,12.57 | 13.17,12.57 13.17,13.37 12.95,13.58 Q3.1 | 13.17,12.57 v13.72,12.57 | Q4.1 8.62,16.75 v8.51,16.64
  Top 0.254: R10.2 R11.2 20.62,2.03 v20.79,1.86
  Bottom 0.2: v30.5,1.68 29.71,0.89 25.44,0.89 24.62,1.71 20.94,1.71 v20.79,1.86 19.98,2.67 17.14,2.67 16.26,1.78 15.54,1.78 15.24,2.08 15.24,2.5 15.41,2.67 v15.41,3.09 | v8.51,16.64 9.31,15.83 9.31,14.92 11.65,12.57 v13.72,12.57
CLK
  Top 0.2: U6.2 16.16,13.24 15.63,12.72 15.26,12.72 15.07,12.53 15.07,8.69 16.16,7.6 U5.2 16.16,5.31 16.38,5.08 18.65,5.08 18.92,4.81 18.92,4.45 19.81,3.56 U8.2
CLK_ISO
  Top 0.2: U8.6 18.8,4.06 19.65,3.21 20.16,3.21 21.69,1.68 24.66,1.68 25.96,2.98 26.42,2.98 | U9.4 26.42,2.98 | R5.2 26.42,2.98
DATA  (via drill 0.25)
  Top 0.2: U7.2 13.84,1.4 13.46,1.78 v13.46,2.29 | v21.84,18.67 20.32,18.67 20.05,18.93 U6.9
  Bottom 0.2: v13.46,2.29 14.1,2.92 14.1,4.33 15.99,6.22 29.32,6.22 30.1,7 30.1,8.43 31.11,9.44 31.11,15.12 28.7,17.53 22.99,17.53 v21.84,18.67
DATA_ISO  (via drill 0.25)
  Top 0.2: U9.5 27.46,2.06 27.05,1.65 25.38,1.65 24.52,0.8 v24.13,0.8 | v17.4,0.76 17.38,0.75 U7.4
  Bottom 0.2: v24.13,0.8 17.43,0.8 v17.4,0.76
GND  (via drill 0.25)
  Top 0.2: U5.15 16.16,12.6 16.51,12.95 19.43,12.95 | 19.43,12.95 19.77,12.95 20.05,13.24 U6.8 20.05,14.87 18.23,16.7 17.47,16.7 16.77,17.4 16.13,17.4 | U5.10 19.41,12.93 19.43,12.95 | U2.12 26.92,12.7 27.18,12.95 30.48,12.95 30.73,13.21 U3.8 30.73,15.49 27.81,18.41 v26.92,18.41 U3.12 | U9.8 U9.EP | v24.77,18.41 24.38,18.8 U3.14 | U10.4 7.05,2 7.34,2.28 10.24,2.28 C5.- | 16.13,17.4 14.48,17.4 | U6.15 16.16,17.43 16.13,17.4 | v27.54,1.42 27.54,0.91 27.56,0.89
  Top 0.254: 14.48,14.1 14.48,13.46 v14.35,13.34 14.34,13.32 14.34,5.22 14.62,4.94 15.22,4.94 15.75,4.42 v15.75,4.19 16.09,3.85 16.68,3.85 U1.2 | 14.48,14.1 14.48,17.4 C1.2 | R7.1 R6.1 22.37,4.21 22.01,4.56 U8.4 20.85,4.56 20.71,4.7 20.05,4.7 | R5.1 26.53,0.89 27.56,0.89 C2.2 28.96,1.28 U9.8 | 24.38,10.16 23.88,10.16 23.75,10.29 v23.37,10.29 | 24.38,10.16 26.92,10.16 | 26.92,10.16 28.19,10.16 30.73,7.62 U2.8 | R4.2 34.74,6.48 34.86,6.35 U4.2 36.2,6.35 36.45,6.6 36.45,8.25 J2.3 | U2.14 24.38,10.16 | U2.12 26.92,10.16 | U7.3 15.61,0.75 15.75,0.89 15.75,1.29 | 15.75,1.29 v15.75,2.29 | U5.8 20.05,4.7 | v19.43,4.7 20.05,4.7 | R2.2 37.34,1.79 37.08,1.53 v36.83,1.53 | 15.75,1.29 17.74,1.29 18.15,0.89 R10.1 | Q3.2 14.46,14.08 14.48,14.1
  Top 0.406: C5.- 10.41,7.87 4.57,13.72 C3.2 | 4.83,18.07 C3.2 | Q1.2 2.98,18.22 3.68,18.92 4.57,18.92 | 4.57,18.92 U11.2 v9.82,18.92 10.55,18.92 10.79,18.67 C4.2 | C3.2 4.57,18.92
  Bottom 0.2: v26.92,18.41 v24.77,18.41
  Bottom 0.254: v9.82,18.92 9.82,14.95 11.56,13.21 13.72,13.21 13.84,13.34 v14.35,13.34 14.35,11.05 15.49,9.91 17.09,9.91 17.47,10.29 v23.37,10.29 | v15.75,4.19 16.26,4.19 | 16.26,4.19 18.16,4.19 18.67,4.7 v19.43,4.7 24,4.7 26.42,2.29 27.56,2.29 | 27.56,2.29 30.74,2.29 31.67,1.35 33.27,1.35 | J2.3 36.96,9.39 38,8.36 38,2.7 v36.83,1.53 36.65,1.35 33.27,1.35 | ISP1.6 33.27,1.35 | 27.56,2.29 27.54,2.26 v27.54,1.42 | v15.75,2.29 16.26,2.79 16.26,4.19
LOAD  (via drill 0.25)
  Top 0.2: U8.5 17.58,4.56 17.48,4.46 U1.3 16.24,4.46 15.35,5.35 15.25,5.35 14.87,5.73 v14.87,6.6 | v25.65,10.69 U2.13 25.65,12.71 26.29,13.34 26.29,17.53 25.65,18.16 U3.13
  Bottom 0.2: v14.87,6.6 15.78,7.51 15.78,7.8 17.5,9.52 24.48,9.52 v25.65,10.69
LOAD_ISO
  Top 0.2: U9.2 25.85,3.88 25.53,3.56 23.11,3.56 | U8.3 21.98,4.06 22.48,3.56 23.11,3.56 | R6.2 23.11,3.56
MISO  (via drill 0.25)
  Top 0.2: U9.20 27.2,4.93 v27.05,5.08
  Bottom 0.2: v27.05,5.08 27.81,5.08 28.32,4.57 31.88,4.57 ISP1.1
N$1
  Top 0.2: U6.11 18.75,18.38 18.97,18.16 22.61,18.16 23.11,18.67 U3.15
N$2
  Top 0.2: U6.12 18.11,18.22 18.57,17.76 20.6,17.76 21.84,16.51 U3.1
N$3
  Top 0.2: U6.13 17.45,18.09 18.15,17.4 20.45,17.4 21.16,16.69 21.16,13.37 21.48,13.05 22.86,13.05 23.11,13.31 U3.2
N$4
  Top 0.2: U3.3 24.38,12.95 24.13,12.7 21.34,12.7 20.81,13.22 20.81,16.55 20.31,17.05 17.62,17.05 16.8,17.87 U6.14
N$5  (via drill 0.25)
  Top 0.2: U6.3 16.8,14.8 v16.75,14.86 | v25.65,16.32 U3.4
  Bottom 0.2: v16.75,14.86 16.75,15.03 17.86,16.14 19.62,16.14 19.73,16.04 25.37,16.04 v25.65,16.32
N$6  (via drill 0.25)
  Top 0.2: U6.4 v17.45,14.86 | v17.45,14.86 | v26.92,15.79 U3.5
  Bottom 0.2: v17.45,14.86 17.45,15.03 18.22,15.79 19.48,15.79 19.58,15.69 26.82,15.69 v26.92,15.79
N$7  (via drill 0.25)
  Top 0.2: U6.5 18.11,14.8 v18.16,14.86 | v28.19,15.26 U3.6
  Bottom 0.2: v28.19,15.26 28.17,15.24 19.53,15.24 19.33,15.44 18.74,15.44 v18.16,14.86
N$8  (via drill 0.25)
  Top 0.2: U6.6 18.75,14.69 v18.92,14.86 | v29.46,15.24 U3.7
  Bottom 0.2: v18.92,14.86 19.05,14.73 28.96,14.73 v29.46,15.24
N$9  (via drill 0.25, 0.3)
  Top 0.2: v29.46,7.37 U2.7 | U5.6 18.75,6.11 18.75,6.83 19.03,7.11 v19.05,7.11
  Bottom 0.2: v29.46,7.37 29.22,7.12 v19.06,7.12 v19.05,7.11
N$10  (via drill 0.25)
  Top 0.2: v28.19,7.67 U2.6 | v18.29,7.11 18.11,6.93 U5.5
  Bottom 0.2: v28.19,7.67 18.85,7.67 v18.29,7.11
N$11  (via drill 0.25)
  Top 0.2: U5.4 17.45,7.02 v17.55,7.11 | v26.92,8.23 U2.5
  Bottom 0.2: v17.55,7.11 17.55,7.39 18.24,8.08 26.77,8.08 v26.92,8.23
N$12  (via drill 0.25)
  Top 0.2: U5.3 16.8,7.08 v16.84,7.11 | v25.65,8.64 U2.4
  Bottom 0.2: v16.84,7.11 16.84,7.57 17.91,8.64 v25.65,8.64
N$13
  Top 0.2: U5.14 16.8,10.88 20.46,7.23 20.46,5.58 20.47,5.58 21.06,4.98 24.03,4.98 24.38,5.33 U2.3
N$14
  Top 0.2: U5.13 17.45,10.73 20.81,7.37 20.81,5.73 21.21,5.33 22.99,5.33 23.11,5.46 U2.2
N$15
  Top 0.2: U2.1 21.34,6.22 21.16,6.39 21.16,7.52 18.11,10.58 U5.12
N$16
  Top 0.2: U5.11 18.75,11.09 18.92,10.92 22.99,10.92 23.11,11.05 U2.15
N$17  (via drill 0.25)
  Top 0.2: U5.9 20.05,12.71 20.46,13.12 20.46,15.23 19.94,15.75 v19.94,16.55 | v19.43,18.67 19.43,19.66 U6.10
  Bottom 0.2: v19.43,18.67 19.94,18.16 v19.94,16.55
N$18
  Top 0.2: U3.11 28.19,18.67 31.37,15.49 31.37,11.94 31.24,11.82 U2.9
N$19  (via drill 0.25)
  Top 0.254: R4.1 32.3,7.66 v32.38,7.75
  Bottom 0.254: v32.38,7.75 32.89,7.75 33.15,8 JP0.3
N$20  (via drill 0.25)
  Top 0.254: v33.91,16.26 33.91,18.25 33.53,18.63 R3.1
  Bottom 0.254: JP0.1 33.15,15.49 v33.91,16.26
N$21
  Top 0.254: R9.1 10.54,14.67 10.62,14.75 Q2.1 11.78,14.75 12.16,15.13 Q3.3
PULSE
  Top 0.2: U4.1 35.5,7.63 34.23,8.9 34.23,11.75 34.41,11.93 J2.2
  Bottom 0.254: JP0.2 J2.2
PULSE_DIG  (via drill 0.25)
  Top 0.2: v30.86,8.26 30.86,8.38 28.19,11.05 U2.11
  Top 0.254: U4.4 37.47,5.77 v37.47,6.35
  Bottom 0.2: v37.47,6.35 31.24,6.35 30.86,6.73 v30.86,8.26
RST
  Top 0.2: U1.1 17.35,3.16 17.75,3.56 U8.7
RST_ISO
  Top 0.2: U9.3 25.91,3.43 25.39,2.91 R7.2 24.26,2.29 24,2.03 21.84,2.03 21.36,2.51 U8.1
SCL  (via drill 0.25)
  Top 0.2: U9.1 26.79,4.33 v26.42,4.7 | U10.2 7.46,1.2 v7.54,1.27
  Bottom 0.2: ISP1.3 27.69,3.43 v26.42,4.7 25.6,5.52 16.28,5.52 14.8,4.04 14.8,2.37 13.71,1.27 v7.54,1.27
SCL_HV
  Top 0.2: U10.7 5.03,1.2 4.59,1.63 4.59,4.43 3.43,5.59 J1.1
SDA  (via drill 0.25)
  Top 0.2: U9.16 30.46,4.93 v30.61,5.08 | U10.3 7.15,1.6 7.33,1.78 v8,1.78
  Bottom 0.2: ISP1.4 33.91,3.43 34.16,3.68 34.16,5.08 33.66,5.59 31.11,5.59 v30.61,5.08 28.31,5.08 27.52,5.87 16.14,5.87 14.45,4.18 14.45,2.51 13.71,1.78 v8,1.78
SDA_HV
  Top 0.2: U10.6 5.13,1.6 4.95,1.78 4.95,6.77 3.43,8.29 J1.2
V_CAP
  Top 0.2: 11.41,12.43 11.25,12.26 C5.+ 11.05,12.26 11.41,12.62 Q2.2
  Top 0.406: Q4.3 8.51,12.45 8.69,12.26 C5.+
V_CAP_READ  (via drill 0.25)
  Top 0.2: U9.15 31,4.33 31.23,4.56 31.23,5.02 31.37,5.16 31.37,6.48 31.37,8.46 30.48,9.35 v30.48,9.53 | v12.19,13.74 12.19,14.33 Q2.3
  Bottom 0.2: v30.48,9.53 30.48,10.5 29.16,11.81 21.54,11.81 21.04,11.3 17.78,11.3 16.76,10.29 15.65,10.29 14.86,11.08 14.86,13.54 14.66,13.74 v12.19,13.74
V_SYS  (via drill 0.25)
  Top 0.2: J2.1 36.71,14.47 37.4,13.78 U4.5 | U8.8 17.75,3.06 17.4,2.71 16.17,2.71 16,2.87 16,3.22 15.41,3.81 U1.5 | U6.16 15.51,19.06 15.26,18.81 C1.1 13.86,18.81 12.83,17.78 D1.CAT
  Top 0.254: 15.51,10.92 U5.16 | v20.83,19.68 U3.16 | v20.83,11.81 v20.83,11.82 U2.16 | R1.2 35.94,2.58 36.79,3.43 37.88,3.43 38.21,3.75 38.21,6.74 37.95,7 U4.5 | R3.2 32.77,15.49 33.79,14.47 J2.1 | U1.5 13.84,3.81 12.83,4.82 12.83,8.04 v13.81,9.02 | 15.51,10.92 15.51,9.49 v16,8.99 | v16.13,10.92 15.51,10.92
  Top 0.406: v13.72,16.49 D1.CAT 11.91,16.49 11.32,15.89 R9.2 9.78,15.89 9.51,15.62 7.92,15.62 7.56,15.99 Q4.2
  Bottom 0.254: v16.13,10.92 16.13,11.81 | 16.13,11.81 16.13,13.69 14.86,14.96 14.86,16.49 | v13.72,16.49 14.86,16.49 | 14.86,16.49 15.34,16.49 18.54,19.68 v20.83,19.68 31.75,19.68 35.31,16.13 J2.1 | v20.83,11.81 16.13,11.81 | v13.81,9.02 15.98,9.02 v16,8.99
VIN+  (via drill 0.25)
  Top 0.2: J1.3 3.43,10.83 2.42,9.82 2.42,5.88 4.24,4.06 4.24,1.48 4.92,0.8 U10.8
  Top 0.254: U11.1 7.43,19.87 v7.49,19.81 | v7.49,17.91 6.46,17.91 U11.3
  Top 0.406: U11.1 4.67,19.87 C3.1 4.53,19.81 1.49,19.81 1.08,19.41 Q1.1 1.08,15.17 3.43,12.83 J1.3
  Bottom 0.254: v7.49,19.81 v7.49,17.91
VIN-
  Top 0.406: Q1.3 2.03,15.88 J1.4
VREF
  Top 0.254: R2.1 R1.1 35.18,5 35.5,5.32 U4.3

### Text on the board
bDocu: To Logger / 3.3v ~ 5v | Vin- | Pullup | Vcc | ± | Vin+ | J0 | Pulse | SDA | Pulldown | GND | SCL | To Sensor / 0v ~ Vcc | Project Tally v1.1 / -------------- / Developed by / Northern Widget and / University of Minnesota